# Altium schematic sheet 3_USB.schdoc
size 210 x 148 mm; Symbol: tv_muban1_1; Company: 嘉立创EDA; Version: V1.0; Page Size: A4; @Project Name: LCEDAsucaiku; @Update Date: 2026-05-01; @Create Date: 2026-03-27; @Page Name: USB; @Page Count: 8; @Page No: 3; @Update Time: 18:57:04; Color: #990000; Device: sucai_muban; @Board Name: tv基板; @Create Time: 22:33:56; @Schematic Name: Schematic1; @Assembly Variant: Basic; Border: 1; Title Block Position: 3; Size: A4; Width: 826; Height: 582; Region Start: 1; X Region Count: 6; Y Region Count: 4; Blade Width: 10; SheetNumber: 3; SheetTotal: 8
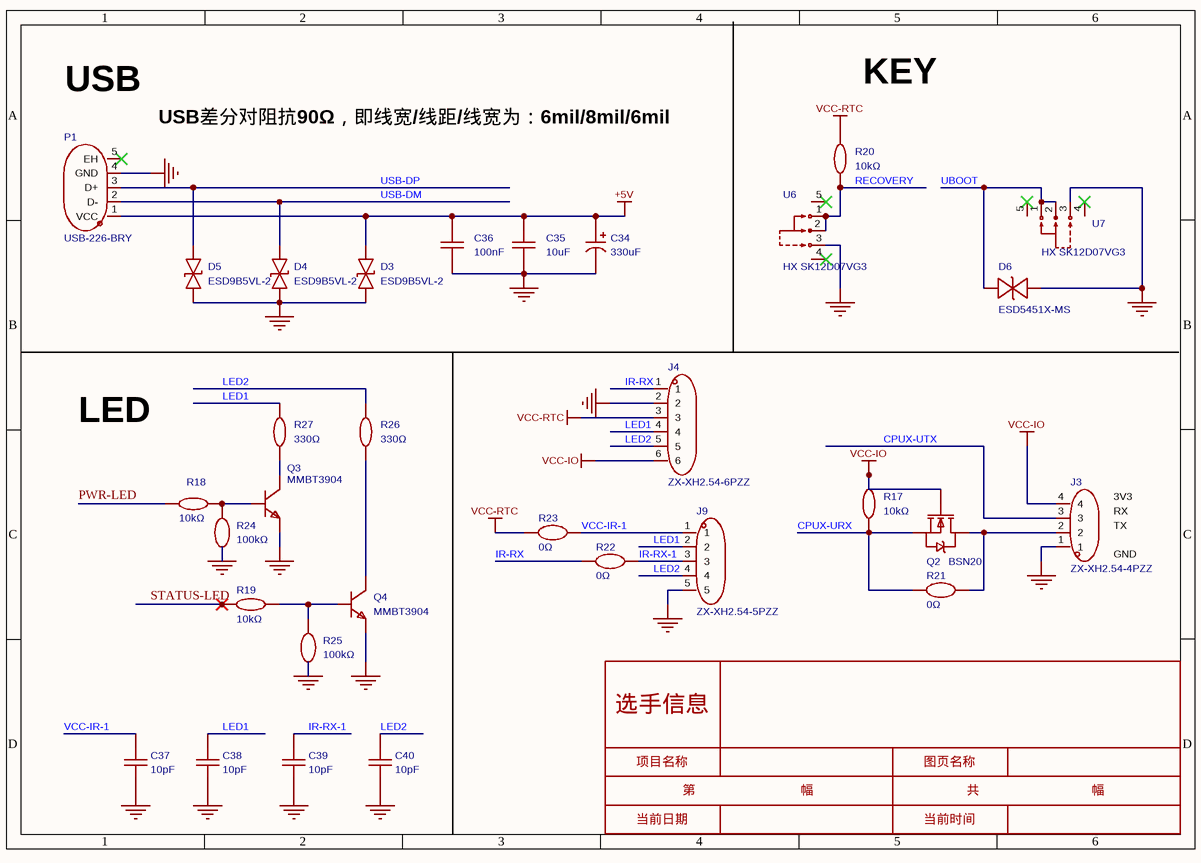
[diagram p0: 3_USB.schdoc]

## Parts
C34  330uF  [CAP-TH_BD6.3-P2.50-D0.6-FD-3]
C35  10uF  [C0805]
C36  100nF  [C0402]
C37  10pF  [C0402]
C38  10pF  [C0402]
C39  10pF  [C0402]
C40  10pF  [C0402]
D3  ESD9B5VL-2  [DFN1006-2L-BI]
D4  ESD9B5VL-2  [DFN1006-2L-BI]
D5  ESD9B5VL-2  [DFN1006-2L-BI]
D6  ESD5451X-MS  [DFN1006-2L-BI]
J3  ZX-XH2.54-4PZZ  [CONN-TH_4P-P2.50_4PIN]
J4  ZX-XH2.54-6PZZ  [CONN-TH_6P-P2.50_ZX-XH2.54-6PZZ]
J9  ZX-XH2.54-5PZZ  [CONN-TH_5P-P2.50_ZX-XH2.54-5PZZ]
P1  USB-226-BRY  [USB-A-TH_USB-226-BRY]
Q2  BSN20  [SOT-23-3_L2.9-W1.6-P1.90-LS2.8-BR]
Q3  MMBT3904  [SOT-23-3_L2.9-W1.3-P1.90-LS2.4-BR]
Q4  MMBT3904  [SOT-23-3_L2.9-W1.3-P1.90-LS2.4-BR]
R17  10kΩ  [R0402]
R18  10kΩ  [R0402]
R19  10kΩ  [R0402]
R20  10kΩ  [R0402]
R21  0Ω  [R0402]
R22  0Ω  [R0402]
R23  0Ω  [R0402]
R24  100kΩ  [R0402]
R25  100kΩ  [R0402]
R26  330Ω  [R0402]
R27  330Ω  [R0402]
U6  HX SK12D07VG3  [SW-TH_SK12D07VG3]
U7  HX SK12D07VG3  [SW-TH_SK12D07VG3]

## Nets
+5V: C34.1 C35.2 C36.2 D3.2 P1.1(VCC)
GND: C34.2 C35.1 C36.1 C37.1 C38.1 C39.1 C40.1 D3.1 D4.1 D5.1 D6.2 J3.1 J4.2 J9.5 P1.4(GND) Q3.2(E) Q4.2(E) R24.1 R25.1 U6.3 U7.3
VCC-IO: J3.4 J4.6 Q2.1(G) R17.2
VCC-RTC: J4.3 R20.2 R23.1
CPUX-URX: Q2.2(S) R17.1 R21.1
CPUX-UTX: J3.3
IR-RX: J4.1 R22.1
IR-RX-1: C39.2 J9.3 R22.2
LED1: C38.2 J4.4 J9.2 R27.2
LED2: C40.2 J4.5 J9.4 R26.2
PWR-LED: R18.1
RECOVERY: R20.1 U6.1 U6.2
STATUS-LED: R19.1
UBOOT: D6.1 U7.1 U7.2
USB-DM: D4.2 P1.2(D-)
USB-DP: D5.2 P1.3(D+)
VCC-IR-1: C37.2 J9.1 R23.2
NetJ3_2: J3.2 Q2.3(D) R21.2
NetQ3_1: Q3.1(B) R18.2 R24.2
NetQ3_3: Q3.3(C) R27.1
NetQ4_1: Q4.1(B) R19.2 R25.2
NetQ4_3: Q4.3(C) R26.1

Not connected (* = marked no-connect by the designer): P1 5(EH)*; U6 4* 5*; U7 4* 5*

## Notes on the sheet
- (near R20) KEY
- USB
- USB差分对阻抗90Ω，即线宽/线距/线宽为：6mil/8mil/6mil
- LED
- (near J3) RX
- (near J3) 3V3
- (near J3) GND
- (near J3) TX
- 选手信息
- 项目名称
- 第                              幅
- 图页名称
- 共                                幅
- 当前日期
- 当前时间

## Library data of the parts
C34 = PB16V330M6X11: 容值:330uF;精度:±20%;额定电压:16V;纹波电流:4.1A@100kHz;等效串联电阻(ESR):16mΩ@100kHz;类型:聚合物;; Manufacturer: JIERR(捷而瑞); AddInBom: yes; Tolerance: ±20%; Voltage Rating: 16V; Type: 聚合物; Pin Spacing: 2.5mm; Lifetime: 5000hrs@105℃; Symbol: PB16V330M6X11; Device: PB16V330M6X11; LCSC Part Name: 330uF ±20% 16V; SupplierPart: C51934161; ManufacturerPart: PB16V330M6X11; Supplier Footprint: 插件,D6.3xL11mm; JLCPCB Part Class: Extended Part; Datasheet: https://item.szlcsc.com/datasheet/PB16V330M6X11/54649573.html; Supplier: LCSC; ConvertToPcb: yes; FootprintName: CAP-TH_BD6.3-P2.50-D0.6-FD-3; Value: 330uF; Ripple Current: 4.1A@100kHz; Equivalent Series Resistance(ESR): 16mΩ@100kHz; Diameter: 6.3mm; Height - Seated (Max): 11mm; Operating Temperature: -55℃~+105℃
C35 = CGA0805X5R106K500MT: 容值:10uF;精度:±10%;额定电压:50V;温度系数:X5R;; Manufacturer: HRE(芯声); AddInBom: yes; ModelId: 1ba041120af144c991958decab20d241聨0819f05c4eef4c71ace90d822a990e87; ModelName: C0805_L2.0-W1.3-H1.3; ModelTransform: 78.74,51.181,0,0,0,0,0,0.0005,0; Tolerance: ±10%; Voltage Rating: 50V; Temperature Coefficient: X5R; Symbol: CGA0805X5R106K500MT; Device: CGA0805X5R106K500MT; LCSC Part Name: 10uF ±10% 50V; SupplierPart: C6119889; ManufacturerPart: CGA0805X5R106K500MT; Supplier Footprint: 0805; JLCPCB Part Class: Extended Part; Datasheet: https://item.szlcsc.com/datasheet/CGA0805X5R106K500MT/7062595.html; Supplier: LCSC; ConvertToPcb: yes; FootprintName: C0805; Value: 10uF
C36 = CL05B104KO5NNNC: 容值:100nF;精度:±10%;额定电压:16V;温度系数:X7R;; Manufacturer: SAMSUNG(三星); AddInBom: yes; ModelId: 36a51122f27c49738f86b3bfa98863e0聨0819f05c4eef4c71ace90d822a990e87; ModelName: C0402_L1.0-W0.5-H0.5; ModelTransform: 39.37,19.685,0,0,0,0,0,0,0; Tolerance: ±10%; Voltage Rating: 16V; Temperature Coefficient: X7R; Symbol: CL05B104KO5NNNC; Device: CL05B104KO5NNNC; LCSC Part Name: 100nF ±10% 16V; SupplierPart: C1525; ManufacturerPart: CL05B104KO5NNNC; Supplier Footprint: 0402; JLCPCB Part Class: Basic Part; Datasheet: https://item.szlcsc.com/datasheet/CL05B104KO5NNNC/1877.html; Supplier: LCSC; ConvertToPcb: yes; FootprintName: C0402; Value: 100nF
C37-C40 = CL05C100JB5NNNC: 容值:10pF;精度:±5%;额定电压:50V;温度系数:C0G;; Manufacturer: SAMSUNG(三星); 3D Model: 36a51122f27c49738f86b3bfa98863e0聨0819f05c4eef4c71ace90d822a990e87; 3D Model Transform: 39.37,19.685,0,0,0,0,0,0,0; Tolerance: ±5%; Voltage Rating: 50V; Temperature Coefficient: C0G; AddInBom: yes; ModelName: C0402_L1.0-W0.5-H0.5; Symbol: CL05C100JB5NNNC; Device: CL05C100JB5NNNC; LCSC Part Name: 10pF ±5% 50V; Supplier Part: C32949; Manufacturer Part: CL05C100JB5NNNC; Supplier Footprint: 0402; JLCPCB Part Class: Basic Part; Datasheet: https://item.szlcsc.com/datasheet/CL05C100JB5NNNC/33914.html; Supplier: LCSC; Value: 10pF; ConvertToPcb: yes; FootprintName: C0402
D3-D5 = ESD9B5VL-2: 反向截止电压(Vrwm):5V;钳位电压:12.5V;峰值脉冲功率(Ppp):80W@8/20us;击穿电压:6V;; Manufacturer: Leiditech(雷卯电子); AddInBom: yes; ModelId: 2bdbcca3b35b49c5a8ae725a08658930聨0819f05c4eef4c71ace90d822a990e87; ModelTransform: 40.1574,24.4094,0,0,0,0,0,0,0; Reverse Stand-Off Voltage (Vrwm): 5V; Clamping Voltage: 12.5V; Voltage - Breakdown: 6V; Reverse Leakage Current (Ir): 500nA; level of protection: IEC 61000-4-5；IEC 61000-4-2; Type: ESD; Junction Capacitance: 15pF; Symbol: ESD9B5VL-2; Device: ESD9B5VL-2; LCSC Part Name: ESD 5V截止; SupplierPart: C5144823; ManufacturerPart: ESD9B5VL-2; Supplier Footprint: DFN1006-2; JLCPCB Part Class: Extended Part; Datasheet: https://item.szlcsc.com/datasheet/ESD9B5VL-2/5766708.html; Supplier: LCSC; ConvertToPcb: yes; FootprintName: DFN1006-2L-BI; ModelName: DFN1006-2L-BI; Peak Pulse Power Dissipation (Ppp): 80W@8/20us
D6 = ESD5451X-MS: 反向截止电压(Vrwm):5V;峰值脉冲电流(Ipp):8A;击穿电压:5.6V;; Manufacturer: MSKSEMI(美森科); 3D Model: 2bdbcca3b35b49c5a8ae725a08658930聨0819f05c4eef4c71ace90d822a990e87; 3D Model Transform: 40.1574,24.4094,0,0,0,0,0,0,0; Reverse Stand-Off Voltage (Vrwm): 5V; Peak Pulse Current (Ipp): 8A; Breakdown Voltage: 5.6V; Type: ESD; AddInBom: yes; Symbol: ESD5451X-MS; Device: ESD5451X-MS; LCSC Part Name: 丝印C; Supplier Part: C7379960; Manufacturer Part: ESD5451X-MS; Supplier Footprint: DFN1006-2L; JLCPCB Part Class: Extended Part; Datasheet: https://atta.szlcsc.com/upload/public/pdf/source/20230621/69F6BD434835CFDE06A31A18B4149936.pdf; Supplier: LCSC; ConvertToPcb: yes; FootprintName: DFN1006-2L-BI; ModelName: DFN1006-2L-BI
J3 = ZX-XH2.54-4PZZ: 插针结构:1x4P;间距:2.5mm;安装方式:直插;参考系列:XH;总PIN数:4P;排数:1;每排PIN数:4;行距:-;额定电流:3A;触头材质:黄铜;触头镀层:锡;工作温度:-25℃~+85℃;; Manufacturer: Megastar(兆星); 3D Model: 5458b55d28744a3c82c1e0e5bffe4e87聨0819f05c4eef4c71ace90d822a990e87; 3D Model Transform: 492.125,224.409,0,180,0,0,0,17.717,-118.11; Pins Structure: 1x4P; Pitch: 2.5mm; Reference Series: XH; Number of PINs Per Row: 4; Current Rating: 3A; Voltage Rating: 250V; Plastic Material: PA66; Flame Retardant Rating: UL94V-0; Z-Height of the Board: 7mm; X-Length of Bottom Edge on Board (Spacing Line): 12.5mm; Y-Width of Bottom Edge on Board: 5.9mm; AddInBom: yes; Symbol: ZX-XH2.54-4PZZ; Device: ZX-XH2.54-4PZZ; LCSC Part Name: 1x4P 间距:2.5mm 直插 系列:XH; Supplier Part: C7429634; Manufacturer Part: ZX-XH2.54-4PZZ; Supplier Footprint: 插件,P=2.5mm; JLCPCB Part Class: Extended Part; Datasheet: https://item.szlcsc.com/datasheet/ZX-XH2.54-4PZZ/8427551.html; Supplier: LCSC; Mounting Type: 直插; Number of Pins: 4P; Number of Rows: 1; Row Spacing: -; Contact Material: 黄铜; Contact Plating: 锡; Operating Temperature: -25℃~+85℃; Supplementary Features: -; Color: 白色; ConvertToPcb: yes; FootprintName: CONN-TH_4P-P2.50_4PIN; ModelName: CONN-TH_4P-P2.50_4PIN
J4 = ZX-XH2.54-6PZZ: 插针结构:1x6P;间距:2.5mm;安装方式:直插;参考系列:XH;总PIN数:6P;排数:1;每排PIN数:6;行距:-;额定电流:3A;触头材质:黄铜;触头镀层:锡;工作温度:-25℃~+85℃;; Manufacturer: Megastar(兆星); 3D Model: 69bbd5a736b94698bef26e8b4cdae04d聨0819f05c4eef4c71ace90d822a990e87; 3D Model Transform: 688.975,232.6767,0,0,0,0,0,14.528,-133.858; Pins Structure: 1x6P; Pitch: 2.5mm; Reference Series: XH; Number of PINs Per Row: 6; Current Rating: 3A; Voltage Rating: 250V; Plastic Material: PA66; Flame Retardant Rating: UL94V-0; Z-Height of the Board: 7mm; X-Length of Bottom Edge on Board (Spacing Line): 17.5mm; Y-Width of Bottom Edge on Board: 5.9mm; AddInBom: yes; Symbol: ZX-XH2.54-6PZZ; Device: ZX-XH2.54-6PZZ; LCSC Part Name: 1x6P 间距:2.5mm 直插 系列:XH; Supplier Part: C7429636; Manufacturer Part: ZX-XH2.54-6PZZ; Supplier Footprint: 插件,P=2.5mm; JLCPCB Part Class: Extended Part; Datasheet: https://item.szlcsc.com/datasheet/ZX-XH2.54-6PZZ/8427553.html; Supplier: LCSC; Mounting Type: 直插; Number of Pins: 6P; Number of Rows: 1; Row Spacing: -; Contact Material: 黄铜; Contact Plating: 锡; Operating Temperature: -25℃~+85℃; Supplementary Features: -; Color: 白色; ConvertToPcb: yes; FootprintName: CONN-TH_6P-P2.50_ZX-XH2.54-6PZZ; ModelName: CONN-TH_6P-P2.50_ZX-XH2.54-6PZZ
J9 = ZX-XH2.54-5PZZ: 插针结构:1x5P;间距:2.5mm;安装方式:直插;参考系列:XH;总PIN数:5P;排数:1;每排PIN数:5;行距:-;额定电流:3A;触头材质:黄铜;触头镀层:锡;工作温度:-25℃~+85℃;; Manufacturer: Megastar(兆星); AddInBom: yes; ModelId: d05584c4f2494e6996f34343461d4ab0聨0819f05c4eef4c71ace90d822a990e87; ModelTransform: 590.55,232.6767,0,0,0,0,0,14.528,-133.858; Pins Structure: 1x5P; Pitch: 2.5mm; Reference Series: XH; Number of PINs Per Row: 5; Current Rating: 3A; Voltage Rating: 250V; Plastic Material: PA66; Flame Retardant Rating: UL94V-0; Z-Height of the Board: 7mm; X-Length of Bottom Edge on Board (Spacing Line): 15mm; Y-Width of Bottom Edge on Board: 5.9mm; Symbol: ZX-XH2.54-5PZZ; Device: ZX-XH2.54-5PZZ; LCSC Part Name: 1x5P 间距:2.5mm 直插 系列:XH; SupplierPart: C7429635; ManufacturerPart: ZX-XH2.54-5PZZ; Supplier Footprint: 插件,P=2.5mm; JLCPCB Part Class: Extended Part; Datasheet: https://item.szlcsc.com/datasheet/ZX-XH2.54-5PZZ/8427552.html; Supplier: LCSC; ConvertToPcb: yes; FootprintName: CONN-TH_5P-P2.50_ZX-XH2.54-5PZZ; ModelName: CONN-TH_5P-P2.50_ZX-XH2.54-5PZZ; Mounting Type: 直插; Number of Pins: 5P; Number of Rows: 1; Row Spacing: -; Contact Material: 黄铜; Contact Plating: 锡; Operating Temperature: -25℃~+85℃; Supplementary Features: -; Color: 白色
P1 = USB-226-BRY: 连接器类型:Type-A;协议标准:USB 2.0;公母:母;安装方式:侧插;触点数量:4P;端口数量:1;额定电流 - 电源:1.5A;工作温度:-20℃~+70℃;; Manufacturer: XUNPU(讯普); AddInBom: yes; ModelId: 688292054bf045d3989335cf0c7d2341聨0819f05c4eef4c71ace90d822a990e87; ModelTransform: 279.527,771.652,0,0,0,0,0.001,-220.231,-157.48; Connector Type: Type-A; Protocol Standard: USB 2.0; Gender: 母; Number of Contacts: 4P; Number of Ports: 1; Current Rating-Power: 1.5A; Voltage Rating: 30V; Detection color: 白色; Symbol: USB-226-BRY; Device: USB-226-BRY; LCSC Part Name: Type-A 母 侧插; SupplierPart: C720523; ManufacturerPart: USB-226-BRY; Supplier Footprint: 插件; JLCPCB Part Class: Extended Part; Datasheet: https://item.szlcsc.com/datasheet/USB-226-BRY/763530.html; Supplier: LCSC; ConvertToPcb: yes; FootprintName: USB-A-TH_USB-226-BRY; ModelName: USB-A-TH_USB-226-BRY; Mounting Type: 侧插; Length: 19.4mm; Operating Temperature: -20℃~+70℃
Q2 = BSN20_C116157: 数量:1个N沟道;漏源电压(Vdss):50V;连续漏极电流(Id):100mA;导通电阻(RDS(on)):10Ω@2.75V,0.2A;耗散功率(Pd):-;阈值电压(Vgs(th)):1.5V@250uA;; Manufacturer: SHIKUES(时科); 3D Model: 89cb27a44ab2466697082bb9fd73a7d0聨0819f05c4eef4c71ace90d822a990e87; 3D Model Transform: 114.173,110.236,0,90,0,0,0,0,0; Number: 1个N沟道; Drain to Source Voltage: 50V; Current - Continuous Drain(Id): 100mA; Input Capacitance(Ciss): 40pF; Reverse Transfer Capacitance (Crss@Vds): 10pF; Type: N沟道; Output Capacitance(Coss): 15pF; AddInBom: yes; ModelName: SOT-23-3L_L2.9-W1.6-H1.1-LS2.8-P0.95; Symbol: BSN20; Device: BSN20_C116157; LCSC Part Name: 1个N沟道 耐压:50V 电流:0.1A; Supplier Part: C116157; Manufacturer Part: BSN20; Supplier Footprint: SOT-23; JLCPCB Part Class: Extended Part; Datasheet: https://item.szlcsc.com/datasheet/BSN20/117410.html; Supplier: LCSC; RDS(on): 10Ω@2.75V,0.2A; Pd - Power Dissipation: -; Gate Threshold Voltage (Vgs(th)): 1.5V@250uA; ConvertToPcb: yes; FootprintName: SOT-23-3_L2.9-W1.6-P1.90-LS2.8-BR
Q3 Q4 = MMBT3904_C7420353: 晶体管类型:NPN;集电极电流(Ic):200mA;集射极击穿电压(Vceo):40V;耗散功率(Pd):200mW;直流电流增益(hFE):100@10mA,1.0V;; Manufacturer: R+O(宏嘉诚); 3D Model: c62791f0466c4ae2a892c056b845b0ca聨0819f05c4eef4c71ace90d822a990e87; 3D Model Transform: 98.425,114.173,0,180,0,0,0.0005,-0.0005,0; type: NPN; Current - Collector(Ic): 200mA; Collector - Emitter Voltage VCEO: 40V; Pd - Power Dissipation: 200mW; Transition frequency(fT): 300MHz; Current - Collector Cutoff: 100nA; Vce Saturation(VCE(sat)): 300mV; Emitter-Base Voltage(Vebo): 6V; AddInBom: yes; ModelName: SOT-23-3P_L2.9-W1.3-H1.0-LS2.4-P0.95; Symbol: MMBT3904_C7420353; Device: MMBT3904_C7420353; LCSC Part Name: hFE:100-300，丝印:1AM NPN 电流:200mA 电压:40V; Supplier Part: C7420353; Manufacturer Part: MMBT3904; Supplier Footprint: SOT-23; JLCPCB Part Class: Extended Part; Datasheet: https://item.szlcsc.com/datasheet/MMBT3904/8397175.html; Supplier: LCSC; DC Current Gain: 100@10mA,1.0V; Operating Temperature: -55℃~+150℃; ConvertToPcb: yes; FootprintName: SOT-23-3_L2.9-W1.3-P1.90-LS2.4-BR
R17-R20 = RC0402FR-0710KL: 电阻类型:厚膜电阻;阻值:10kΩ;精度:±1%;功率:62.5mW;工作电压:50V;温度系数:±100ppm/℃;; Manufacturer: YAGEO(国巨); 3D Model: 98c88bc2b9094f218f3a3e30a7012738聨0819f05c4eef4c71ace90d822a990e87; 3D Model Transform: 39.37,19.685,0,0,0,0,0,0,0; Tolerance: ±1%; Power(Watts): 62.5mW; Voltage-Supply(Max): 50V; AddInBom: yes; ModelName: R0402_L1.0-W0.5-H0.4; Symbol: RC0402FR-0710KL; Device: RC0402FR-0710KL; LCSC Part Name: 厚膜电阻 10kΩ ±1% 62.5mW; Supplier Part: C60490; Manufacturer Part: RC0402FR-0710KL; Supplier Footprint: 0402; JLCPCB Part Class: Extended Part; Datasheet: https://item.szlcsc.com/datasheet/RC0402FR-0710KL/61542.html; Supplier: LCSC; Type: 厚膜电阻; Value: 10kΩ; Temperature Coefficient: ±100ppm/℃; Operating Temperature: -55℃~+155℃; ConvertToPcb: yes; FootprintName: R0402
R21-R23 = FRC0402P000 TS: 电阻类型:厚膜电阻;阻值:0Ω;精度:±5%;功率:62.5mW;工作电压:50V;; Manufacturer: FOJAN(富捷); 3D Model: 98c88bc2b9094f218f3a3e30a7012738聨0819f05c4eef4c71ace90d822a990e87; 3D Model Transform: 39.37,19.685,0,0,0,0,0,0,0; Tolerance: ±5%; Power(Watts): 62.5mW; Voltage-Supply(Max): 50V; AddInBom: yes; ModelName: R0402_L1.0-W0.5-H0.4; Symbol: FRC0402P000 TS; Device: FRC0402P000 TS; LCSC Part Name: 0Ω ±5% 62.5mW 厚膜电阻; Supplier Part: C2906877; Manufacturer Part: FRC0402P000 TS; Supplier Footprint: 0402; JLCPCB Part Class: Extended Part; Supplier: LCSC; Type: 厚膜电阻; Value: 0Ω; Operating Temperature: -55℃~+155℃; ConvertToPcb: yes; FootprintName: R0402
R24 R25 = RT0402BRD07100KL: 电阻类型:薄膜电阻;阻值:100kΩ;精度:±0.1%;功率:62.5mW;最大工作电压:50V;温度系数:±25ppm/℃;; Manufacturer: YAGEO(国巨); 3D Model: 98c88bc2b9094f218f3a3e30a7012738聨0819f05c4eef4c71ace90d822a990e87; 3D Model Transform: 39.37,19.685,0,0,0,0,0,0,0; Tolerance: ±0.1%; Power(Watts): 62.5mW; Overload Voltage (Max): 50V; AddInBom: yes; ModelName: R0402_L1.0-W0.5-H0.4; Symbol: RT0402BRD07100KL; Device: RT0402BRD07100KL; LCSC Part Name: 薄膜电阻 100kΩ ±0.1% 62.5mW; Supplier Part: C852472; Manufacturer Part: RT0402BRD07100KL; Supplier Footprint: 0402; JLCPCB Part Class: Extended Part; Datasheet: https://atta.szlcsc.com/upload/public/pdf/source/20210326/C852472_6283D268A9C33EA67274729CC55E28B1.pdf; Supplier: LCSC; Type: 薄膜电阻; Value: 100kΩ; Temperature Coefficient: ±25ppm/℃; Operating Temperature Range: -55℃~+155℃; ConvertToPcb: yes; FootprintName: R0402
R26 R27 = 0402WGF3300TCE: 电阻类型:厚膜电阻;阻值:330Ω;精度:±1%;功率:62.5mW;工作电压:50V;温度系数:±100ppm/℃;; Manufacturer: UNI-ROYAL(厚声); 3D Model: 98c88bc2b9094f218f3a3e30a7012738聨0819f05c4eef4c71ace90d822a990e87; 3D Model Transform: 39.37,19.685,0,0,0,0,0,0,0; Tolerance: ±1%; Power(Watts): 62.5mW; Voltage-Supply(Max): 50V; AddInBom: yes; ModelName: R0402_L1.0-W0.5-H0.4; Symbol: 0402WGF3300TCE; Device: 0402WGF3300TCE; LCSC Part Name: 330Ω ±1% 62.5mW 厚膜电阻; Supplier Part: C25104; Manufacturer Part: 0402WGF3300TCE; Supplier Footprint: 0402; JLCPCB Part Class: Basic Part; Datasheet: https://item.szlcsc.com/datasheet/0402WGF3300TCE/25847.html; Supplier: LCSC; Type: 厚膜电阻; Value: 330Ω; Temperature Coefficient: ±100ppm/℃; Operating Temperature: -55℃~+155℃; ConvertToPcb: yes; FootprintName: R0402
U6 U7 = HX SK12D07VG3: 电路结构:单刀双掷;安装方式:弯插;开关颜色:黑色;额定电流:300mA;额定电压:50V;工作寿命:8千次;; Manufacturer: hanxia(韩下); AddInBom: yes; ModelId: 951c2d8cae1a45b4bcf1723179613222聨0819f05c4eef4c71ace90d822a990e87; ModelTransform: 342.519,330.708,0,0,0,0,-0.591,-77.99,-118.11; Circuit: 单刀双掷; Actuator Style: 矩形柱状; Switch Height: 7.4mm; Actuator Color: 黑色; Current Rating: 300mA; Voltage Rating: 50V; Life: 8千次; Symbol: HX SK12D07VG3; Device: HX SK12D07VG3; LCSC Part Name: 3脚2两档位SK12D07VG3 1P2T卧式拨动开关,柄长3mm; SupplierPart: C5149832; ManufacturerPart: HX SK12D07VG3; Supplier Footprint: 弯插,8.7x4.7mm; JLCPCB Part Class: Extended Part; Datasheet: https://item.szlcsc.com/datasheet/HX%2520SK12D07VG3/5774346.html; Supplier: LCSC; ConvertToPcb: yes; FootprintName: SW-TH_SK12D07VG3; ModelName: SW-TH_SK12D07VG3; Termination Style: PC引脚; Length: 8.7mm; Width: 4.7mm; Mounting Type: 弯插; Operating Temperature: -25℃~+70℃